# Altium project CAN_SNIFFER.PrjPcb
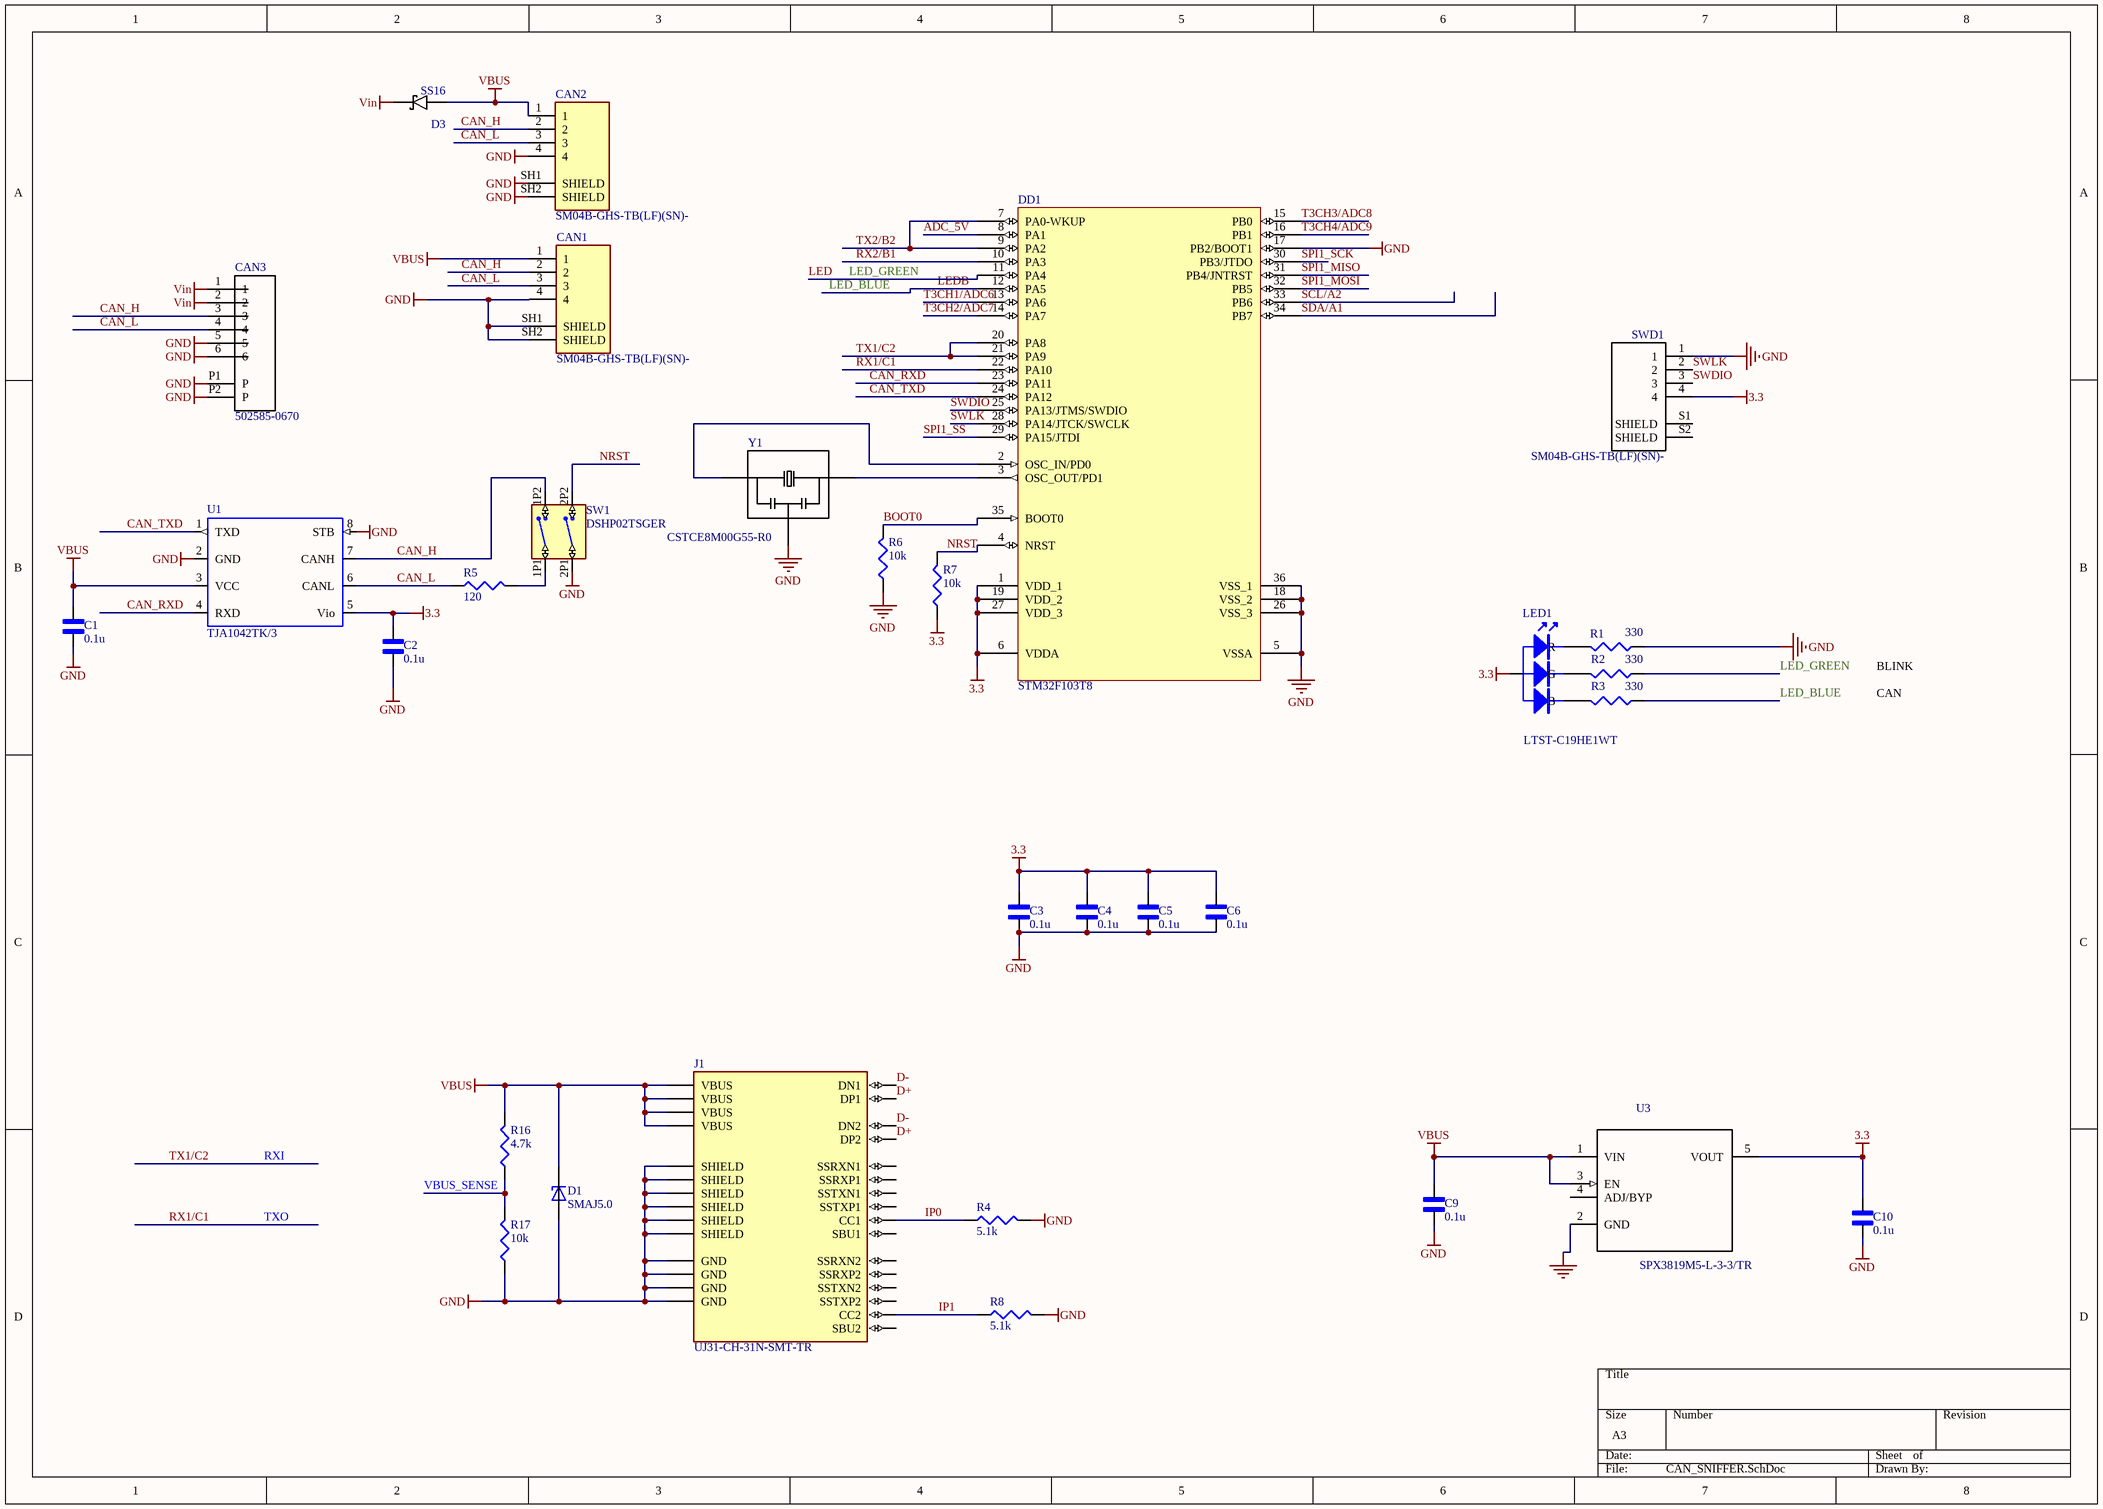
[diagram p0: CAN_SNIFFER.SchDoc]
Version: 1.1
2 sheets, 62 parts. Net scope: global (net labels, ports and power ports of the same name join across sheets).
Board file: CAN_SNIFFER.PcbDoc
Sheets:
  CAN_SNIFFER.SchDoc
  STLINKv2DIY.SchDoc

## Sheet CAN_SNIFFER.SchDoc
size A3

### Parts
C1  value 0.1u  [CAPC1005X55N]  (hidden comment: GCM155R71H104KE02D)
C2  value 0.1u  [CAPC1005X55N]  (hidden comment: GCM155R71H104KE02D)
C3  value 0.1u  [CAPC1005X55N]  (hidden comment: GCM155R71H104KE02D)
C4  value 0.1u  [CAPC1005X55N]  (hidden comment: GCM155R71H104KE02D)
C5  value 0.1u  [CAPC1005X55N]  (hidden comment: GCM155R71H104KE02D)
C6  value 0.1u  [CAPC1005X55N]  (hidden comment: GCM155R71H104KE02D)
C9  value 0.1u  [CAPC1005X55N]  (hidden comment: GCM155R71H104KE02D)
C10  value 0.1u  [CAPC1005X55N]  (hidden comment: GCM155R71H104KE02D)
CAN1  SM04B-GHS-TB(LF)(SN)-  [JST_SM04B-GHS-TB(LF)(SN)-]
CAN2  SM04B-GHS-TB(LF)(SN)-  [JST_SM04B-GHS-TB(LF)(SN)-]
CAN3  502585-0670  [MOLEX_502585-0670]
D1  SMAJ5.0  [DIOM4325X250N]
D3  SS16  [*DIOM5227X250N_SS16(Primary)]
DD1  STM32F103T8  [*QFN50P600X600X100-37N]
J1  UJ31-CH-31N-SMT-TR  [CUI_UJ31-CH-31N-SMT-TR]
LED1  LTST-C19HE1WT  [LTST-C19HE1WT]
R1  value 330  [RESC1005X40N]  (hidden comment: RC0402FR-07330RL)
R2  value 330  [RESC1005X40N]  (hidden comment: RC0402FR-07330RL)
R3  value 330  [RESC1005X40N]  (hidden comment: RC0402FR-07330RL)
R4  value 5.1k  [RESC1005X40N]  (hidden comment: RC0402FR-075K1L)
R5  value 120  [RESC1005X40N]  (hidden comment: RC0402FR-07120RL)
R6  value 10k  [RESC1005X40N]  (hidden comment: RC0402FR-0710KL)
R7  value 10k  [RESC1005X40N]  (hidden comment: RC0402FR-0710KL)
R8  value 5.1k  [RESC1005X40N]  (hidden comment: RC0402FR-075K1L)
R16  value 4.7k  [RESC1005X40N]  (hidden comment: RC0402FR-074K7L)
R17  value 10k  [RESC1005X40N]  (hidden comment: RC0402FR-0710KL)
SW1  DSHP02TSGER  [DSHP02TSGER]
SWD1  SM04B-GHS-TB(LF)(SN)-  [JST_BM04B-GHS-holes]
U1  TJA1042TK/3  [SOT782-1]
U3  SPX3819M5-L-3-3/TR  [*SOT95P280X145-5N]
Y1  CSTCE8M00G55-R0  [*OSC_CSTCE8M00G55-R0]

### Nets
3.3: C2.2 C3.2 C4.2 C5.2 C6.2 C10.2 DD1.1(VDD_1) DD1.6(VDDA) DD1.19(VDD_2) DD1.27(VDD_3) LED1.4(A) R7.1 SWD1.4 U1.5(Vio) U3.5(VOUT)
GND: C1.1 C2.1 C3.1 C4.1 C5.1 C6.1 C9.1 C10.1 CAN1.4 CAN1.SH1(SHIELD) CAN1.SH2(SHIELD) CAN2.4 CAN2.SH1(SHIELD) CAN2.SH2(SHIELD) CAN3.5 CAN3.6 CAN3.P1(P) CAN3.P2(P) D1.A DD1.5(VSSA) DD1.17(PB2/BOOT1) DD1.18(VSS_2) DD1.26(VSS_3) DD1.36(VSS_1) J1.A1(GND) J1.A12(GND) J1.B1(GND) J1.B12(GND) J1.SH1(SHIELD) J1.SH2(SHIELD) J1.SH3(SHIELD) J1.SH4(SHIELD) J1.SH5(SHIELD) J1.SH6(SHIELD) R1.1 R4.2 R6.1 R8.2 R17.1 SW1.2P1 SWD1.1 U1.2(GND) U1.8(STB) U3.2(GND) Y1.2
VBUS: C1.2 C9.2 CAN1.1 CAN2.1 D1.C D3.A J1.A4(VBUS) J1.A9(VBUS) J1.B4(VBUS) J1.B9(VBUS) R16.2 U1.3(VCC) U3.1(VIN) U3.3(EN)
Vin: CAN3.1 CAN3.2 D3.C(K)
ADC_5V: DD1.8(PA1)
BOOT0: DD1.35(BOOT0) R6.2
CAN_H: CAN1.2 CAN2.2 CAN3.3 SW1.1P2 U1.7(CANH)
CAN_L: CAN1.3 CAN2.3 CAN3.4 R5.1 U1.6(CANL)
CAN_RXD: DD1.23(PA11) U1.4(RXD)
CAN_TXD: DD1.24(PA12) U1.1(TXD)
D+: J1.A6(DP1) J1.B6(DP2)
D-: J1.A7(DN1) J1.B7(DN2)
IP0: J1.A5(CC1) R4.1
IP1: J1.B5(CC2) R8.1
LED: DD1.11(PA4) R2.1  [also labelled LED_GREEN]
LED_BLUE: DD1.12(PA5) R3.1  [also labelled LEDB]
NRST: DD1.4(NRST) R7.2 SW1.2P2
RX1/C1: DD1.22(PA10)  [also labelled TXO]
RX2/B1: DD1.10(PA3)
RXI: DD1.20(PA8) DD1.21(PA9)  [also labelled TX1/C2]
SCL/A2: DD1.33(PB6)
SDA/A1: DD1.34(PB7)
SPI1_MISO: DD1.31(PB4/JNTRST)
SPI1_MOSI: DD1.32(PB5)
SPI1_SCK: DD1.30(PB3/JTDO)
SPI1_SS: DD1.29(PA15/JTDI)
SWDIO: DD1.25(PA13/JTMS/SWDIO) SWD1.3
SWLK: DD1.28(PA14/JTCK/SWCLK) SWD1.2
T3CH1/ADC6: DD1.13(PA6)
T3CH2/ADC7: DD1.14(PA7)
T3CH3/ADC8: DD1.15(PB0)
T3CH4/ADC9: DD1.16(PB1)
TX2/B2: DD1.7(PA0-WKUP) DD1.9(PA2)
VBUS_SENSE: R16.1 R17.2
NetDD1_2: DD1.2(OSC_IN/PD0) Y1.1
NetDD1_3: DD1.3(OSC_OUT/PD1) Y1.3
NetLED1_1: LED1.1(R) R1.2
NetLED1_2: LED1.2(G) R2.2
NetLED1_3: LED1.3(B) R3.2
NetR5_2: R5.2 SW1.1P1

Not connected (* = marked no-connect by the designer): J1 A2(SSTXP1) A3(SSTXN1) A8(SBU1) A10(SSRXN2) A11(SSRXP2) B2(SSTXP2) B3(SSTXN2) B8(SBU2) B10(SSRXN1) B11(SSRXP1); SWD1 S1(SHIELD) S2(SHIELD); U3 4(ADJ/BYP)

### Notes on the sheet
- CAN
- BLINK

### Library data of the parts
C1-C6 C9 C10 = GCM155R71H104KE02D: GCM155R71H104KE02D, Чип 0402 X7R 0.1uF +10% 50V,Конденсатор; MF: Murata; Type: SMD; SnapEDA_Link: https://www.snapeda.com/parts/GCM155R71H104KE02D/Murata%20Electronics%20North%20America/view-part/597463/?ref=snap; Package: 0402; MP: GCM155R71H104KE02D; ChipDip_Link: https://www.chipdip.ru/product/gcm155r71h104ke02d-murata
CAN1 CAN2 = SM04B-GHS-TB(LF)(SN)-: Connector Header Surface Mount, Right Angle 4 position 0.049 _1.25mm_; MF: JST Sales; MP: SM04B-GHS-TB(LF)(SN); Package: None; Value: *; SnapEDA_Link: https://www.snapeda.com/parts/SM04B-GHS-TB%28LF%29%28SN%29-/JST%20Sales%20America%20Inc./view-part/2759740/?ref=snap; HelpURL: http://www.farnell.com/datasheets/2082975.pdf; System: Connector; ChipDip_Link: https://www.chipdip.ru/product/sm04b-ghs-tb-lf-sn-gh-1.25mm-header-side-ent; Type: SMD
CAN3 = 502585-0670: 1.50mm Pitch, CLIK-Mate PCB Receptacle, Single Row, Surface Mount, Right-Angle, Tin Plating, Positive Lock, 6 Circuits, Natural; MF: Molex; System: Connector; MP: 502585-0670; Package: None; SnapEDA_Link: https://www.snapeda.com/parts/502494-0670/Molex/view-part/?ref=snap; Value: *; Type: SMD
D1 = SMAJ5.0: 400W, 6.9V, 10%, Unidirectional, TVS; MF: Taiwan Semiconductor; Type: SMD; MP: SMAJ5.0; SnapEDA_Link: https://www.snapeda.com/parts/SMAJ5.0/Taiwan+Semiconductor/view-part/?ref=snap; Value: *; Package: DO-214AC-2 Taiwan Semiconductor
D3 = SS16: Diode Schottky 60V 1A Surface Mount SMA; Instructions: DNP; Type: SMD; SnapEDA_Link: https://www.snapeda.com/parts/SS16/ON%20Semiconductor/view-part/?ref=search&t=ss16; Value: *; ChipDip_Link: https://www.chipdip.ru/product/ss16; MP: SS16; Package: SMA-2
DD1 = STM32F103T8: STM32F103T8U6, Микроконтроллер 32BIT ARM 64K FLASH [VFQFPN-36]; MF: STM; ChipDip_Link: https://www.chipdip.ru/product/stm32f103t8u6-2; HelpURL: http://www.st.com/stonline/products/literature/ds/13587.pdf; MP: STM32F103T8U6; Package: VFQFPN-36; SnapEDA_Link: https://www.snapeda.com/parts/STM32F103T8U6TR/STMicroelectronics/view-part/?ref=search&t=STM32F103T8U6; Type: SMD
J1 = UJ31-CH-31N-SMT-TR: Type C, USB 3.1 Gen 2, 5 A, Right Angle, Surface Mount _SMT_, USB Receptacle; MF: CUI Devices; System: Connector; Value: *; SnapEDA_Link: https://www.snapeda.com/parts/UJ31-CH-31N-SMT-TR/CUI%20Devices/view-part/2776725/?ref=snap; Package: None; MP: UJ31-CH-31N-SMT-TR; ChipDip_Link: https://www.chipdip.ru/product1/8002862225; HelpURL: https://www.chipdip.ru/product1/8002862225; Type: SMT
LED1 = RGB_LED_5MM: Blue/Green/Red; Type: SMD; ChipDip_Link: https://www.chipdip.ru/product1/8003387462; HelpURL: https://static.chipdip.ru/lib/039/DOC013039662.pdf; MP: LTST-C19HE1WT
R1-R3 = RC0402FR-07330RL: 0.062Вт 0402 330 Ом, 1%, Чип резистор (SMD); Pacage Metric: 1005; MF: Yageo or NXP; ChipDip_Link: https://www.chipdip.ru/product0/9000189640; HelpURL: https://www.chipdip.ru/product0/9000189640; Package: RC0402; Type: SMD; MP: RC0402FR-07330RL; SnapEDA_Link: https://www.snapeda.com/parts/CRGCQ0402F10K/TE%20Connectivity/view-part/3186991/?ref=search&t=0402%2010k
R4 R8 = RC0402FR-054K1L: 0.062Вт 0402 5.1 кОм, 1%, Чип резистор (SMD); MF: Yageo or NXP; ChipDip_Link: https://www.chipdip.ru/product0/9000189640; HelpURL: https://www.chipdip.ru/product0/9000189640; Package: RC0402; Type: SMD; MP: RC0402FR-075K1L; SnapEDA_Link: https://www.snapeda.com/parts/CRGCQ0402F10K/TE%20Connectivity/view-part/3186991/?ref=search&t=0402%2010k
R5 = RC0402FR-07120RL: 0.062Вт 0402 120 Ом, 1%, Чип резистор (SMD); MF: Yageo or NXP; ChipDip_Link: https://www.chipdip.ru/product0/9000189640; HelpURL: https://www.chipdip.ru/product0/9000189640; Package: RC0402; Type: SMD; MP: RC0402FR-07120RL; SnapEDA_Link: https://www.snapeda.com/parts/CRGCQ0402F10K/TE%20Connectivity/view-part/3186991/?ref=search&t=0402%2010k
R6 R7 R17 = RC0402FR-0710KL: 0.062Вт 0402 10 кОм, 1%, Чип резистор (SMD); MF: Yageo or NXP; ChipDip_Link: https://www.chipdip.ru/product0/9000189640; HelpURL: https://www.chipdip.ru/product0/9000189640; Package: RC0402; Type: SMD; MP: RC0402FR-0710KL; SnapEDA_Link: https://www.snapeda.com/parts/CRGCQ0402F10K/TE%20Connectivity/view-part/3186991/?ref=search&t=0402%2010k
R16 = RC0402FR-074K7L: 0.062Вт 0402 4.7 кОм, 1%, Чип резистор (SMD); MF: Yageo or NXP; ChipDip_Link: https://www.chipdip.ru/product0/9000189640; HelpURL: https://www.chipdip.ru/product0/9000189640; Package: RC0402; Type: SMD; MP: RC0402FR-074K7L; SnapEDA_Link: https://www.snapeda.com/parts/CRGCQ0402F10K/TE%20Connectivity/view-part/3186991/?ref=search&t=0402%2010k
SW1 = DSHP02TSGER: DSHP Series 1.27mm Pitch DIP Switch 4 POS; MF: KINGTEK INDUSTRIAL; Check_prices: https://www.snapeda.com/parts/DSHP02TSGER/GTE/view-part/4478207/?ref=eda; Package: None; Value: *; MP: DSHP02TSGER; Price: None; Availability: Warning; SnapEDA_Link: https://www.snapeda.com/parts/DSHP02TSGER/GTE/view-part/4478207/?ref=snap; HelpURL: https://item.szlcsc.com/3856577.html
SWD1 = SWD SM04B-GHS-TB(LF)(SN)-: Conn Shrouded Header HDR 4 POS 1.25mm Solder ST SMD Reel; MF: JST Sales; Instructions: DNP; System: Connector; SnapEDA_Link: https://www.snapeda.com/parts/BM04B-GHS-TBT%28LF%29%28SN%29%28N%29/JST%20Sales%20America%20Inc./view-part/?ref=snap; MP: SM04B-GHS-TB(LF)(SN); Package: None; Value: *; Type: SMD
U1 = TJA1042: 1/1 Transceiver Half CANbus 8-SO; MF: NXP USA; SnapEDA_Link: https://www.snapeda.com/parts/TJA1042/NXP%20USA%20Inc./view-part/900919/?ref=snap; Value: *; MP: TJA1042TK/3; Package: VDFN-8 NXP USA; ChipDip_Link: https://www.chipdip.ru/product1/8002840332; HelpURL: https://static.chipdip.ru/lib/583/DOC001583059.pdf; Type: SMD
U3 = SPX3819M5-L-3-3/TR: Low Dropout Voltage Regulator, Adjustable 0.5A, В±1%, 2.5 to 16 Vin, 5-Pin SOT-23; MF: MaxLinear, Inc.; Value: 3V3; MP: SPX3819M5-L-3-3/TR; Package: SOT-23-5 Exar; SnapEDA_Link: https://www.snapeda.com/parts/SPX3819M5-L/MaxLinear%2C%20Inc./view-part/?ref=snap; Type: SMD; ChipDip_Link: https://www.chipdip.ru/product1/8003455237; HelpURL: http://www.farnell.com/datasheets/2614478.pdf
Y1 = CSTCE8M00G55-R0: Ceramic Resonator 8MHz ??0.5% _Tol_ ??0.2% _Stability_ 33pF 40Ohm 3-Pin CSMD T/R; MF: Murata; MP: CSTCE8M00G55-R0; Package: SMD-3 Murata; SnapEDA_Link: https://www.snapeda.com/parts/CSTCE8M00G55-R0/Murata%20Electronics%20North%20America/view-part/?ref=snap; Value: *; ChipDip_Link: https://www.chipdip.ru/product1/8001783721; HelpURL: https://www.murata.com/en-eu/api/pdfdownloadapi?cate=&partno=CSTCE8M00G55-R0; Type: SMD

## Sheet STLINKv2DIY.SchDoc
size A4
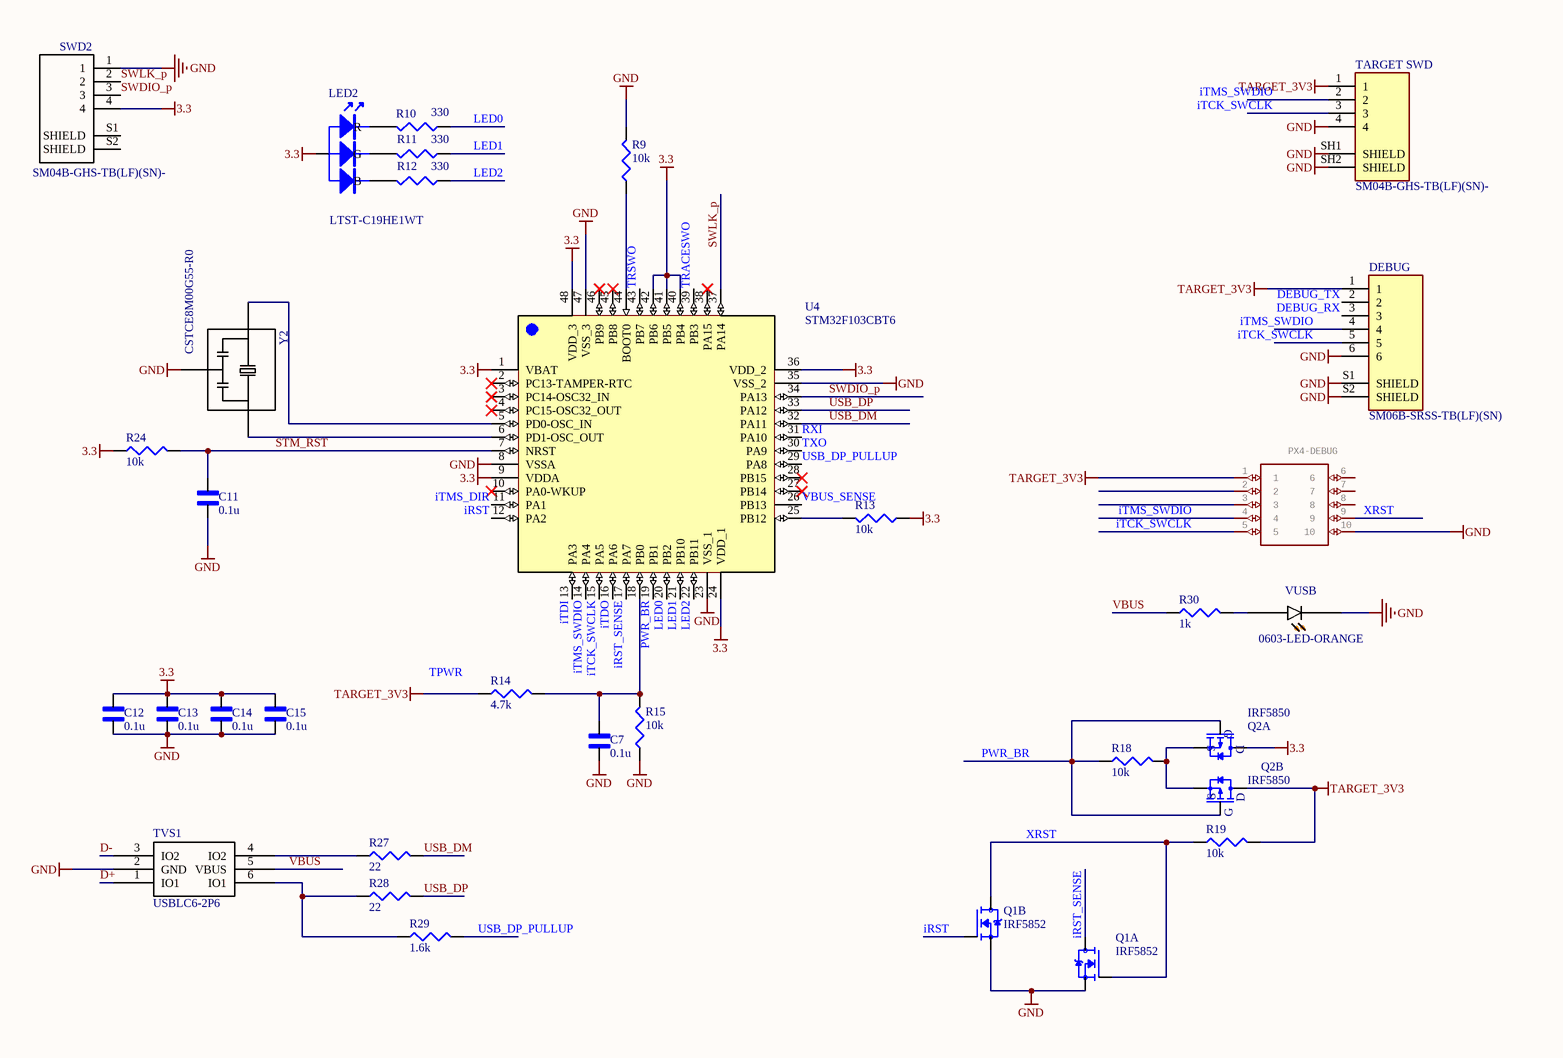
[diagram p1: STLINKv2DIY.SchDoc]

### Parts
C7  value 0.1u  [CAPC1005X55N]  (hidden comment: GCM155R71H104KE02D)
C11  value 0.1u  [CAPC1005X55N]  (hidden comment: GCM155R71H104KE02D)
C12  value 0.1u  [CAPC1005X55N]  (hidden comment: GCM155R71H104KE02D)
C13  value 0.1u  [CAPC1005X55N]  (hidden comment: GCM155R71H104KE02D)
C14  value 0.1u  [CAPC1005X55N]  (hidden comment: GCM155R71H104KE02D)
C15  value 0.1u  [CAPC1005X55N]  (hidden comment: GCM155R71H104KE02D)
DEBUG  SM06B-SRSS-TB(LF)(SN)  [JST_SM06B-SRSS-TB(LF)(SN)]
LED2  LTST-C19HE1WT  [LTST-C19HE1WT]
PX4-DEBUG  JST (JAPAN SOLDERLESS TERMINALS) - SM10B-SRSS-TB(LF)(SN) - HEADER, R/A, 10WAY   Source:  Datasheet  [SM10B-SRSS-TB]  (value not drawn)
Q1  IRF5852  [SOT23-6]  (parts A,B of 2)
Q2  IRF5850  [SOT23-6]  (parts A,B of 2)
R9  value 10k  [RESC1005X40N]  (hidden comment: RC0402FR-0710KL)
R10  value 330  [RESC1005X40N]  (hidden comment: RC0402FR-07330RL)
R11  value 330  [RESC1005X40N]  (hidden comment: RC0402FR-07330RL)
R12  value 330  [RESC1005X40N]  (hidden comment: RC0402FR-07330RL)
R13  value 10k  [RESC1005X40N]  (hidden comment: RC0402FR-0710KL)
R14  value 4.7k  [RESC1005X40N]  (hidden comment: RC0402FR-074K7L)
R15  value 10k  [RESC1005X40N]  (hidden comment: RC0402FR-0710KL)
R18  value 10k  [RESC1005X40N]  (hidden comment: RC0402FR-0710KL)
R19  value 10k  [RESC1005X40N]  (hidden comment: RC0402FR-0710KL)
R24  value 10k  [RESC1005X40N]  (hidden comment: RC0402FR-0710KL)
R27  value 22  [RESC1005X40N]  (hidden comment: RC0402FR-0722RL)
R28  value 22  [RESC1005X40N]  (hidden comment: RC0402FR-0722RL)
R29  value 1.6k  [RESC1005X40N]  (hidden comment: RC0402FR-071K6L)
R30  value 1k  [RESC1005X40N]  (hidden comment: RC0402FR-071KL)
SWD2  SM04B-GHS-TB(LF)(SN)-  [JST_BM04B-GHS-holes]
TARGET_SWD  SM04B-GHS-TB(LF)(SN)-  [JST_SM04B-GHS-TB(LF)(SN)-]
TVS1  USBLC6-2P6  [SOT23127P600-8N]
U4  STM32F103CBT6  [STM-LQFP48_N]
VUSB  0603-LED-ORANGE  [*LEDM1608X80_LTE-C1906R-14(Primary)]
Y2  CSTCE8M00G55-R0  [*OSC_CSTCE8M00G55-R0]

### Nets
3.3: C12.2 C13.2 C14.2 C15.2 LED2.4(A) Q2.6(D) R13.1 R24.1 SWD2.4 U4.1(VBAT) U4.9(VDDA) U4.24(VDD_1) U4.36(VDD_2) U4.40(PB4) U4.41(PB5) U4.42(PB6) U4.48(VDD_3)
GND: C7.1 C11.1 C12.1 C13.1 C14.1 C15.1 DEBUG.6 DEBUG.S1(SHIELD) DEBUG.S2(SHIELD) PX4-DEBUG.10 Q1.2(S) Q1.5(S) R9.2 R15.1 SWD2.1 TARGET_SWD.4 TARGET_SWD.SH1(SHIELD) TARGET_SWD.SH2(SHIELD) TVS1.2(GND) U4.8(VSSA) U4.23(VSS_1) U4.35(VSS_2) U4.47(VSS_3) VUSB.C Y2.2
TARGET_3V3: DEBUG.1 PX4-DEBUG.1 Q2.4(D) R14.1 R19.2 TARGET_SWD.1
VBUS: R30.1 TVS1.5(VBUS)
D+: TVS1.1(IO1)
D-: TVS1.3(IO2)
DEBUG_RX: DEBUG.3
DEBUG_TX: DEBUG.2
iRST: Q1.3(G) U4.12(PA2)
iRST_SENSE: Q1.6(D) U4.17(PA7)
iTCK_SWCLK: DEBUG.5 PX4-DEBUG.5 TARGET_SWD.3 U4.15(PA5)
iTDI: U4.13(PA3)
iTDO: U4.16(PA6)
iTMS_DIR: U4.11(PA1)
iTMS_SWDIO: DEBUG.4 PX4-DEBUG.4 TARGET_SWD.2 U4.14(PA4)
LED0: R10.1 U4.20(PB2)
LED1: R11.1 U4.21(PB10)
LED2: R12.1 U4.22(PB11)
PWR_BR: Q2.1(G) Q2.3(G) R18.1 U4.19(PB1)
RXI: U4.31(PA10)
STM_RST: C11.2 R24.2 U4.7(NRST)
SWDIO_p: SWD2.3 U4.34(PA13)
SWLK_p: SWD2.2 U4.37(PA14)
TRACESWO: U4.39(PB3)
TRSWO: U4.43(PB7)
TXO: U4.30(PA9)  [project net RX1/C1]
USB_DM: R27.2 U4.32(PA11)
USB_DP: R28.2 U4.33(PA12)
USB_DP_PULLUP: R29.2 U4.29(PA8)
VBUS_SENSE: U4.26(PB13)
XRST: PX4-DEBUG.9 Q1.1(G) Q1.4(D) R19.1
NetC7_2: C7.2 R14.2 R15.2 U4.18(PB0)
NetLED2_1: LED2.1(R) R10.2
NetLED2_2: LED2.2(G) R11.2
NetLED2_3: LED2.3(B) R12.2
NetQ2_2: Q2.2(S) Q2.5(S) R18.2
NetR9_1: R9.1 U4.44(BOOT0)
NetR13_2: R13.2 U4.25(PB12)
NetR27_1: R27.1 TVS1.4(IO2)
NetR28_1: R28.1 R29.1 TVS1.6(IO1)
NetR30_2: R30.2 VUSB.A
NetU4_5: U4.5(PD0-OSC_IN) Y2.1
NetU4_6: U4.6(PD1-OSC_OUT) Y2.3

Not connected (* = marked no-connect by the designer): PX4-DEBUG 2 3 6 7 8; SWD2 S1(SHIELD) S2(SHIELD); U4 2(PC13-TAMPER-RTC)* 3(PC14-OSC32_IN)* 4(PC15-OSC32_OUT)* 10(PA0-WKUP)* 27(PB14)* 28(PB15)* 38(PA15)* 45(PB8)* 46(PB9)*

### Notes on the sheet
- Labels drawn without touching a wire or pin: TPWR

### Library data of the parts
C7 C11-C15 = GCM155R71H104KE02D: as C1 on sheet CAN_SNIFFER; SnapEDA_Link: https://www.snapeda.com/parts/GCM155R71H104KE02D/Murata%20Electronics%20North%20America/view-part/597463/?ref=snap; Package: 0402; MP: GCM155R71H104KE02D; ChipDip_Link: https://www.chipdip.ru/product/gcm155r71h104ke02d-murata
DEBUG = SM06B-SRSS-TB(LF)(SN): Connector Header Surface Mount, Right Angle 6 position 0.039 _1.00mm_; MP: SM06B-SRSS-TB_LF__SN_; MF: JST Sales; Package: None; Value: *; SnapEDA_Link: https://www.snapeda.com/parts/SM06B-SRSS-TB%28LF%29%28SN%29/JST%20Sales%20America%20Inc./view-part/554386/?ref=snap; Type: SMD; HelpURL: https://www.farnell.com/datasheets/2082363.pdf
LED2 = RGB_LED_5MM: Blue/Green/Red; Type: SMD; ChipDip_Link: https://www.chipdip.ru/product1/8003387462; HelpURL: https://static.chipdip.ru/lib/039/DOC013039662.pdf; MP: LTST-C19HE1WT
PX4-DEBUG = SM10B-SRSS-TB_LF__SN_: GateName_1: G$1; MF: JST Sales; SymbolName_1: SM10B-SRSS-TB_LF__SN_; LibraryName: SM10B-SRSS-TB_LF__SN_; DeviceSetName: SM10B-SRSS-TB_LF__SN_; Package: SM10B-SRSS-TB; Manufacturer_Name: JST (JAPAN SOLDERLESS TERMINALS); Manufacturer_Part_Number: SM10B-SRSS-TB(LF)(SN); Height: mm; MP: SM10B-SRSS-TB; HelpURL: https://www.farnell.com/datasheets/2082363.pdf
Q1 = IRF5852: Mosfet Array 2 N-Channel _Dual_ 20V 2.7A 960mW Surface Mount 6-TSOP; MF: Infineon; Value: *; MP: IRF5852; SnapEDA_Link: https://www.snapeda.com/parts/IRF5852/Infineon%20Technologies/view-part/593138/?ref=snap; Package: TSOP-6 International Rectifier; ChipDip_Link: https://www.chipdip.ru/product/irf5852trpbf; HelpURL: https://static.chipdip.ru/lib/300/DOC000300076.pdf
Q2 = IRF5850: Mosfet Array 2 P-Channel (Dual) 20V 2.2A 960mW Surface Mount 6-TSOP; MF: Infineon; Value: *; Check_prices: https://www.snapeda.com/parts/IRF5850/Infineon+Technologies/view-part/?ref=eda; Availability: In Stock; Package: TSOP-6 International Rectifier; SnapEDA_Link: https://www.snapeda.com/parts/IRF5850/Infineon+Technologies/view-part/?ref=snap; Purchase-URL: https://pricing.snapeda.com/search/part/IRF5850/?ref=eda; Price: None; MP: IRF5850
R9 R13 R15 R18 R19 R24 = RC0402FR-0710KL: as R6 on sheet CAN_SNIFFER; ChipDip_Link: https://www.chipdip.ru/product0/9000189640; HelpURL: https://www.chipdip.ru/product0/9000189640; Package: RC0402; Type: SMD; MP: RC0402FR-0710KL; SnapEDA_Link: https://www.snapeda.com/parts/CRGCQ0402F10K/TE%20Connectivity/view-part/3186991/?ref=search&t=0402%2010k
R10-R12 = RC0402FR-07330RL: as R1 on sheet CAN_SNIFFER; ChipDip_Link: https://www.chipdip.ru/product0/9000189640; HelpURL: https://www.chipdip.ru/product0/9000189640; Package: RC0402; Type: SMD; MP: RC0402FR-07330RL; SnapEDA_Link: https://www.snapeda.com/parts/CRGCQ0402F10K/TE%20Connectivity/view-part/3186991/?ref=search&t=0402%2010k
R14 = RC0402FR-074K7L: as R16 on sheet CAN_SNIFFER; ChipDip_Link: https://www.chipdip.ru/product0/9000189640; HelpURL: https://www.chipdip.ru/product0/9000189640; Package: RC0402; Type: SMD; MP: RC0402FR-074K7L; SnapEDA_Link: https://www.snapeda.com/parts/CRGCQ0402F10K/TE%20Connectivity/view-part/3186991/?ref=search&t=0402%2010k
R27 R28 = RC0402FR-0722RL: 0.062Вт 0402 22 Ом, 1%, Чип резистор (SMD); MF: Yageo or NXP; ChipDip_Link: https://www.chipdip.ru/product0/9000189640; HelpURL: https://www.chipdip.ru/product0/9000189640; Package: RC0402; Type: SMD; MP: RC0402FR-0722RL; SnapEDA_Link: https://www.snapeda.com/parts/CRGCQ0402F10K/TE%20Connectivity/view-part/3186991/?ref=search&t=0402%2010k
R29 = RC0402FR-071K6L: 0.062Вт 0402 1.6 кОм, 1%, Чип резистор (SMD); MF: Yageo or NXP; ChipDip_Link: https://www.chipdip.ru/product0/9000189640; HelpURL: https://www.chipdip.ru/product0/9000189640; Package: RC0402; Type: SMD; MP: RC0402FR-071K6L; SnapEDA_Link: https://www.snapeda.com/parts/CRGCQ0402F10K/TE%20Connectivity/view-part/3186991/?ref=search&t=0402%2010k
R30 = RC0402FR-071KL: 0.062Вт 0402 1 кОм, 1%, Чип резистор (SMD); MF: Yageo or NXP; ChipDip_Link: https://www.chipdip.ru/product0/9000189640; HelpURL: https://www.chipdip.ru/product0/9000189640; Package: RC0402; Type: SMD; MP: RC0402FR-071KL; SnapEDA_Link: https://www.snapeda.com/parts/CRGCQ0402F10K/TE%20Connectivity/view-part/3186991/?ref=search&t=0402%2010k
SWD2 = SWD SM04B-GHS-TB(LF)(SN)-: as SWD1 on sheet CAN_SNIFFER; SnapEDA_Link: https://www.snapeda.com/parts/BM04B-GHS-TBT%28LF%29%28SN%29%28N%29/JST%20Sales%20America%20Inc./view-part/?ref=snap; MP: SM04B-GHS-TB(LF)(SN); Package: None; Value: *; Type: SMD
TARGET_SWD = SM04B-GHS-TB(LF)(SN)-: as CAN1 on sheet CAN_SNIFFER; MP: SM04B-GHS-TB(LF)(SN); Package: None; Value: *; SnapEDA_Link: https://www.snapeda.com/parts/SM04B-GHS-TB%28LF%29%28SN%29-/JST%20Sales%20America%20Inc./view-part/2759740/?ref=snap; HelpURL: http://www.farnell.com/datasheets/2082975.pdf; System: Connector; ChipDip_Link: https://www.chipdip.ru/product/sm04b-ghs-tb-lf-sn-gh-1.25mm-header-side-ent; Type: SMD
TVS1 = USBLC6-2P6: 17V Clamp 5A (8/20µs) Ipp Tvs Diode Surface Mount SOT-666; MF: STM; ChipDip_Link: https://www.chipdip.ru/product/usblc6-2p6-2; HelpURL: https://static.chipdip.ru/lib/093/DOC001093117.pdf; MP: USBLC6-2P6; Package: SOT-666; SnapEDA_Link: https://www.snapeda.com/parts/USBLC6-2P6/STMicroelectronics/view-part/?ref=search&t=USBLC6-2P6; Type: SMD
U4 = STM32F103CBT6: ARM® Cortex®-M3 STM32F1 Microcontroller IC 32-Bit 72MHz 128KB (128K x 8) FLASH; Instructions: STM32F103CBT6 - should be B letter not 8; MF: STM; ChipDip_Link: https://www.chipdip.ru/product/stm32f103cbt6; HelpURL: https://static.chipdip.ru/lib/235/DOC000235733.pdf; MP: STM32F103CBT6; Package: LQFP-48; SnapEDA_Link: https://www.snapeda.com/parts/STM32F103CBT6/STMicroelectronics/view-part/?ref=search&t=STM32F103CBT6; Type: SMD
VUSB = 0603-LED-ORANGE: Orange 605nm LED Indication - Discrete 2.2V 0603 (1608 Metric); MP: LTST-C194KFKT; Package: 0603 Lite-On; SnapEDA_Link: https://www.snapeda.com/parts/SML-D12D1WT86/Rohm/view-part/?ref=search&t=0603%20LED%20orange; Value: ORANGE; Type: SMD
Y2 = CSTCE8M00G55-R0: as Y1 on sheet CAN_SNIFFER; MP: CSTCE8M00G55-R0; Package: SMD-3 Murata; SnapEDA_Link: https://www.snapeda.com/parts/CSTCE8M00G55-R0/Murata%20Electronics%20North%20America/view-part/?ref=snap; Value: *; ChipDip_Link: https://www.chipdip.ru/product1/8001783721; HelpURL: https://www.murata.com/en-eu/api/pdfdownloadapi?cate=&partno=CSTCE8M00G55-R0; Type: SMD

## Nets that join several sheets
3.3: CAN_SNIFFER (15 pins), STLINKv2DIY (17 pins)
GND: CAN_SNIFFER (45 pins), STLINKv2DIY (25 pins)
VBUS: CAN_SNIFFER (14 pins), STLINKv2DIY (R30.1 TVS1.5)
D+: CAN_SNIFFER (J1.A6 J1.B6), STLINKv2DIY (TVS1.1)
D-: CAN_SNIFFER (J1.A7 J1.B7), STLINKv2DIY (TVS1.3)
RX1/C1: CAN_SNIFFER (DD1.22), STLINKv2DIY (U4.30)
RXI: CAN_SNIFFER (DD1.20 DD1.21), STLINKv2DIY (U4.31)
VBUS_SENSE: CAN_SNIFFER (R16.1 R17.2), STLINKv2DIY (U4.26)